# EAGLE design OSHW-RGB-Badge_v10 (EAGLE 6.6.0)
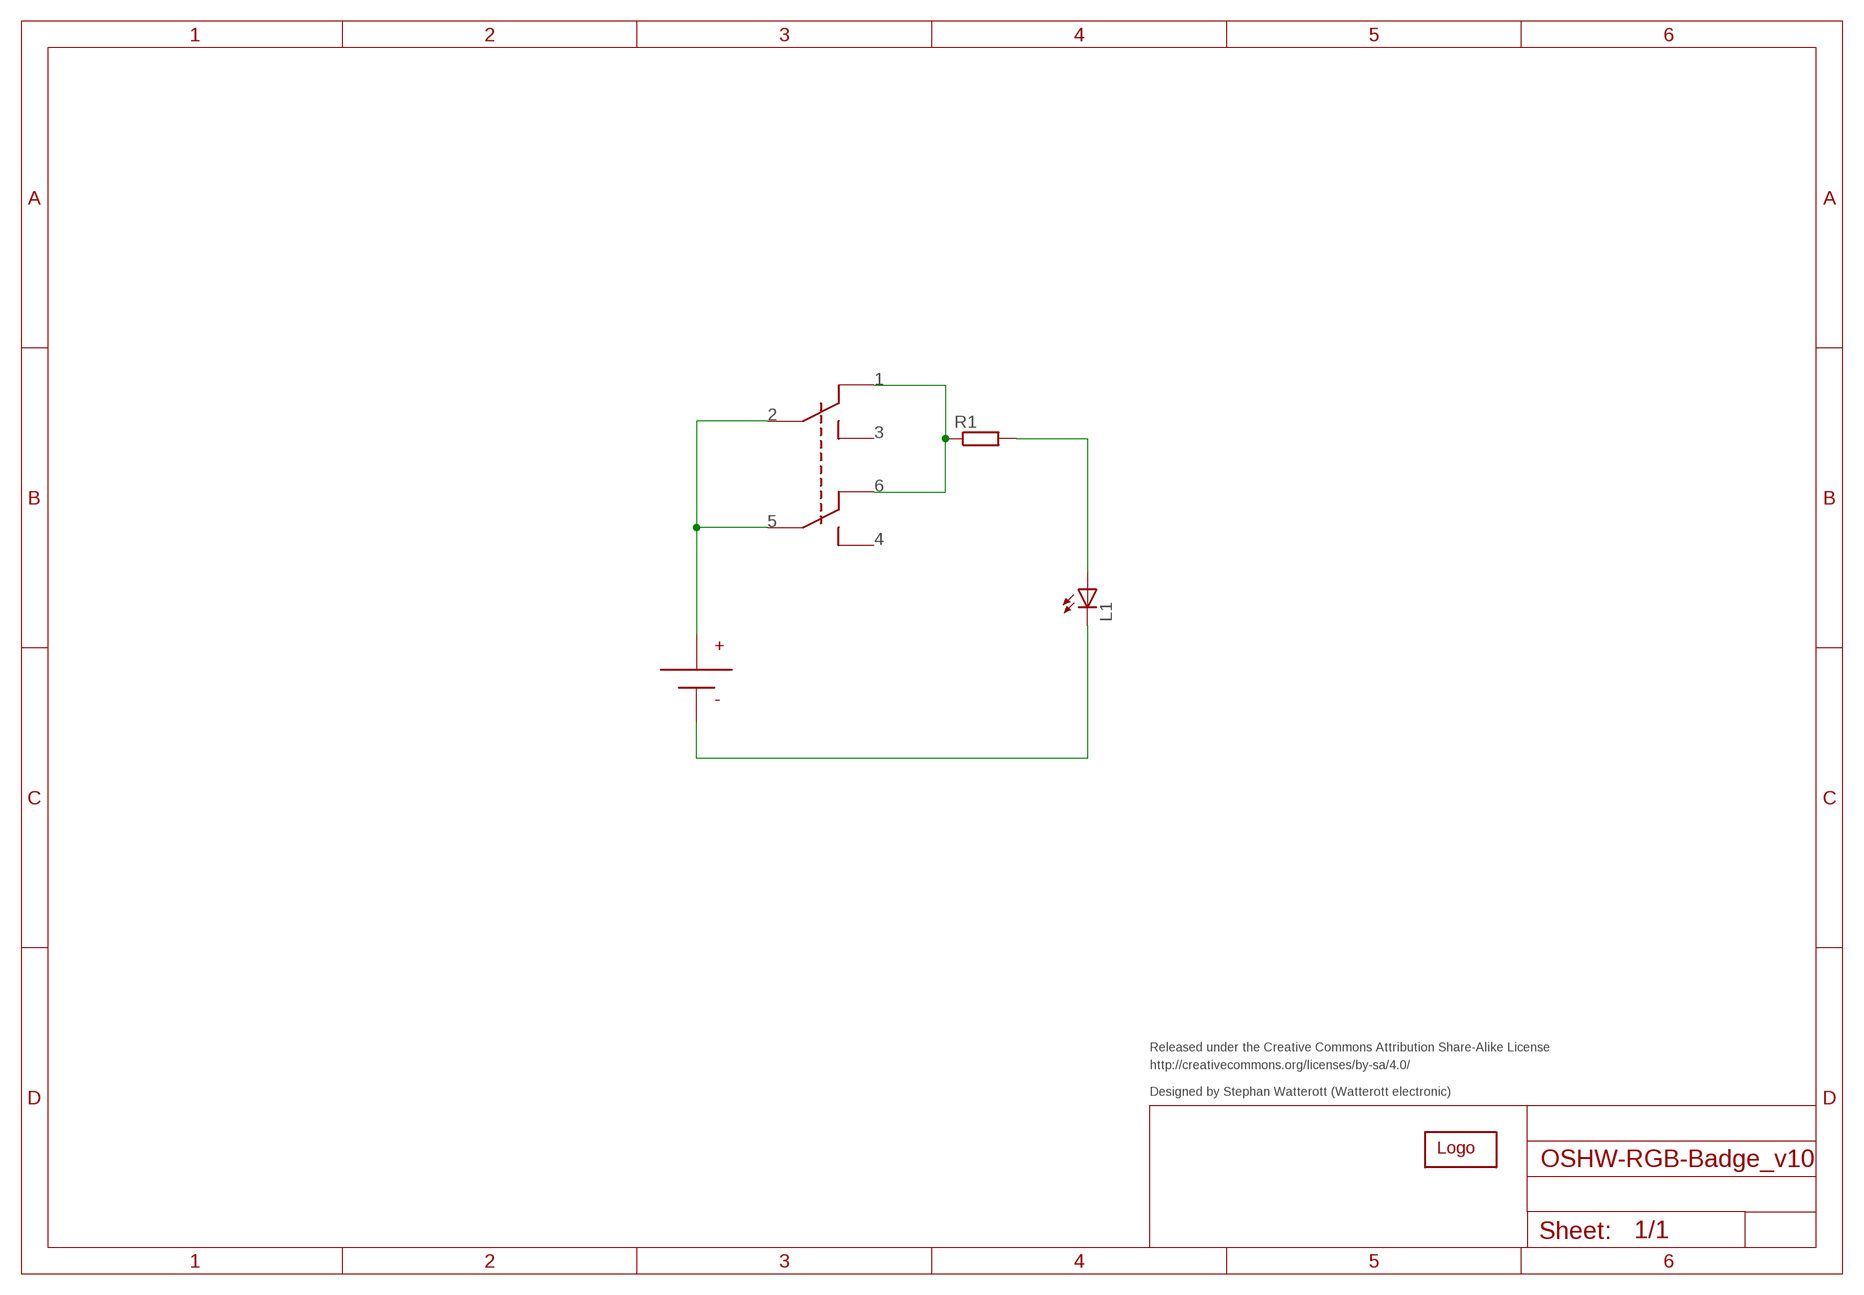
[diagram p0: schematic, sheet 1]

## Parts
L1  LED10MM  [LED10MM]
LOGO1  LOGOPLACE  [LOGO_TPLACE]
R1  R-EU_0207/7  [0207/7]
SW  SWITCH_6-POL_RM2.54  [SWITCH_6POL_RM2.54]
U$1  CN2032_BATTERY_HOLDER  [CN2032_BATTERY_HOLDER]

## Nets
N$1: R1.1 SW.P$1 SW.P$6
N$2: SW.P$2 SW.P$5 U$1.P$1(+)
N$3: L1.A R1.2
N$4: L1.K(C) U$1.P$2(-)
Unconnected: SW.P$3 SW.P$4

## Notes on the sheet
- Released under the Creative Commons Attribution Share-Alike License
- http://creativecommons.org/licenses/by-sa/4.0/
- Designed by Stephan Watterott (Watterott electronic)

## Library data of the parts
L1 = led:LED: LED OSRAM: - CHIPLED LG R971, LG N971, LY N971, LG Q971, LY Q971, LO R971, LY R971 LH N974, LH R974 LS Q976, LO Q976, LY Q976 LO Q996 - Hyper CHIPLED LW Q18S LB Q993, LB Q99A, LB R99A - SideLED LS A670, LO A670, LY A670, LG A670, LP A670 LB A673, LV A673, LT A673, LW A673 LH A674 LY A675 LS A676, LA A676, LO A676, LY A676, LW A676 LS A679, LY A679, LG A679 - Hyper Micro SIDELED® LS Y876, LA Y876, LO Y876, LY Y876 LT Y87S - SmartLED LW L88C, LW L88S LB L89C, LB L89S, LG L890 LS L89K, LO L89K, LY L89K LS L896, LA L896, LO L896, LY L896 - TOPLED LS T670, LO T670, LY T670, LG T670, LP T670 LSG T670, LSP T670, LSY T670, LOP T670, LYG T670 LG T671, LOG T671, LSG T671 LB T673, LV T673, LT T673, LW T673 LH T674 LS T676, LA T676, LO T676, LY T676, LB T676, LH T676, LSB T676, LW T676 LB T67C, LV T67C, LT T67C, LS T67K, LO T67K, LY T67K, LW E67C LS E67B, LA E67B, LO E67B, LY E67B, LB E67C, LV E67C, LT E67C LW T67C LS T679, LY T679, LG T679 LS T770, LO T770, LY T770, LG T770, LP T770 LB T773, LV T773, LT T773, LW T773 LH T774 LS E675, LA E675, LY E675, LS T675 LS T776, LA T776, LO T776, LY T776, LB T776 LHGB T686 LT T68C, LB T68C - Hyper Mini TOPLED® LB M676 - Mini TOPLED Santana® LG M470 LS M47K, LO M47K, LY M47K Source: http://www.osram.convergy.de LUXEON: - LUMILED® LXK2-PW12-R00, LXK2-PW12-S00, LXK2-PW14-U00, LXK2-PW14-V00 LXK2-PM12-R00, LXK2-PM12-S00, LXK2-PM14-U00 LXK2-PE12-Q00, LXK2-PE12-R00, LXK2-PE12-S00, LXK2-PE14-T00, LXK2-PE14-U00 LXK2-PB12-K00, LXK2-PB12-L00, LXK2-PB12-M00, LXK2-PB14-N00, LXK2-PB14-P00, LXK2-PB14-Q00 LXK2-PR12-L00, LXK2-PR12-M00, LXK2-PR14-Q00, LXK2-PR14-R00 LXK2-PD12-Q00, LXK2-PD12-R00, LXK2-PD12-S00 LXK2-PH12-R00, LXK2-PH12-S00 LXK2-PL12-P00, LXK2-PL12-Q00, LXK2-PL12-R00 Source: www.luxeon.com KINGBRIGHT: KA-3528ASYC Source: www.kingbright.com
LOGO1 = we-symbol:LOGO
R1 = resistor:R-EU_: RESISTOR, European symbol
SW = welectronic:SWITCH_6-POL_RM2.54
U$1 = CN2032:CN2032_BATTERY_HOLDER

## Board
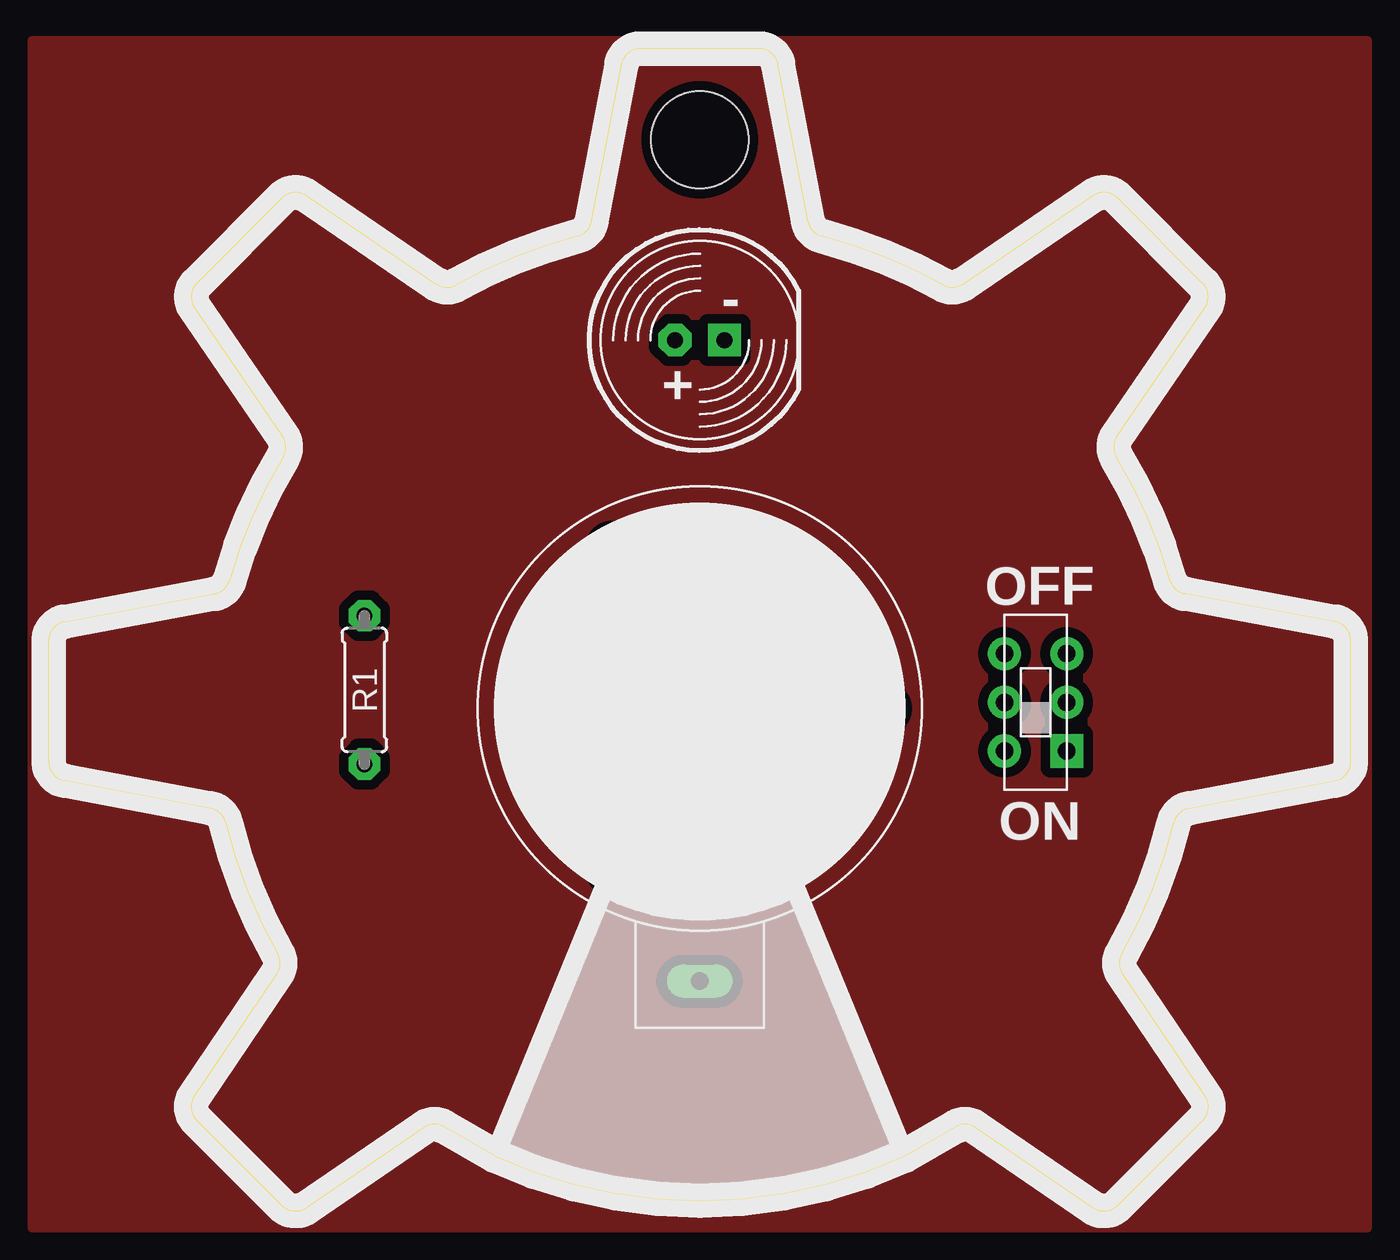
[diagram p1: board, top side]
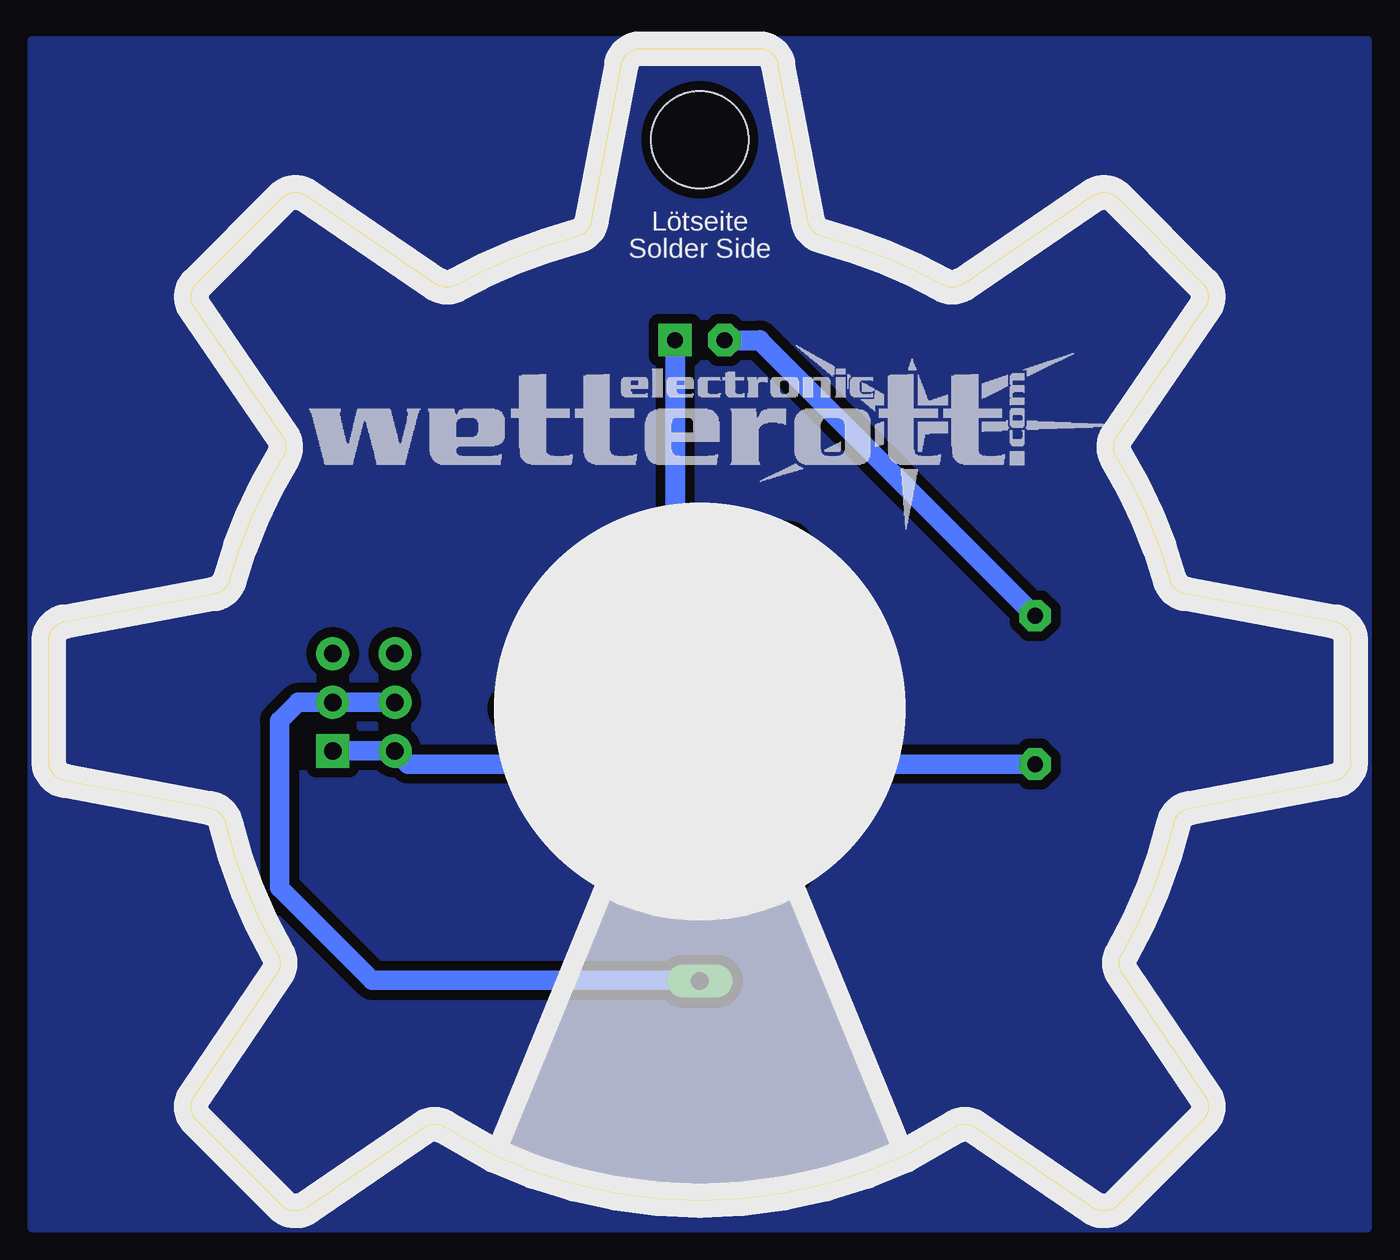
[diagram p2: board, bottom side, seen from below]

Size 66.91 x 59.71 mm. Coordinates in mm from the lower left corner, seen from the top.
Outline: 27.9,50.84 29.42,58.89 arc-79 30.41,59.71 36.51,59.71 arc-79 37.49,58.89 39.02,50.84 arc65 39.75,50.06 arc-15 45.94,47.57 arc64 46.99,47.61 53.66,52.15 arc-79 54.93,52.03 59.29,47.67 arc-79 59.41,46.4 54.9,39.81 arc66 54.87,38.72 arc-16 57.62,32.41 arc64 58.4,31.7 66.09,30.28 arc-80 66.91,29.29 66.91,23.08 arc-79 66.1,22.1 58.6,20.69 arc66 57.81,19.94 arc-17 55.15,13.23 arc64 55.18,12.17 59.42,5.92 arc-79 59.3,4.65 54.93,0.29 arc-79 53.66,0.17 47.65,4.28 arc64 46.59,4.32 44.01,2.83 arc-49 22.91,2.83 20.32,4.32 arc64 19.26,4.28 13.25,0.17 arc-79 11.98,0.29 7.62,4.65 arc-79 7.5,5.92 11.73,12.17 arc64 11.77,13.23 arc-17 9.1,19.94 arc66 8.31,20.69 0.81,22.1 arc-79 0,23.08 0,29.29 arc-80 0.82,30.28 8.51,31.7 arc64 9.3,32.41 arc-16 12.04,38.72 arc66 12.01,39.81 7.5,46.4 arc-79 7.62,47.67 11.98,52.03 arc-79 13.25,52.15 19.92,47.61 arc64 20.97,47.57 arc-15 27.16,50.06 arc65 27.9,50.84
Copper layers (1*16): Top 0.035mm / dielectric 1.5mm / Bottom 0.035mm
Design rules "watterott *": minimum track width 0.15mm, minimum drill 0.3mm, track to track 0.15mm, track to pad 0.15mm, pad to pad 0.15mm, via to via 0.15mm, smd to smd 0.1mm, copper to edge 0.15mm, drill to drill 0.15mm, minimum pad ring 0.4mm, minimum via ring 8mil, stop-mask expansion 4mil, vias tented up to drill 0.5mm, thermal gap 0.2mm
Holes 5 mm at 33.46,55.02

### Footprints (pad centres in the part's own frame; a part is rotated, then mirrored left to right if it is on the bottom)
LED10MM = drill 0.813 pad 1.676 octagon: A -1.27,0 | drill 0.813 pad 1.676 square: K 1.27,0
0207/7 = drill 0.813 octagon: 1 -3.81,0; 2 3.81,0
SWITCH_6POL_RM2.54 = drill 0.9 square: P$1 -1.6,2.5 | drill 0.9: P$2 -1.6,0; P$3 -1.6,-2.5; P$4 1.6,-2.5; P$5 1.6,0; P$6 1.6,2.5
CN2032_BATTERY_HOLDER = drill 0.9 long: P$1 0,-14; P$2 0,6 | hole 1.8: 9.5,0; -4.5,8.25; -4.5,-8.25

### Placement (x,y rotation side)
L1  33.46,44.74 0 top
LOGO1  53.78,34.7 0 bottom
R1  16.23,26.76 90 top
SW  50.72,26.13 180 top
U$1  33.45,25.81 0 top

### Tracks (layer width: path | path; a pad name or v marks a point on that pad's centre or on a via)
GND
  pour Bottom (isolate 0.5): -0.83,60.1 -0.83,-0.86 67.75,-0.86 67.75,60.1
  pour Top (isolate 0.5): -0.83,60.1 67.75,60.1 67.75,-0.86 -0.83,-0.86
N$1
  Bottom 1: R1.1 48.44,22.96 SW.P$6 SW.P$1
N$2
  Bottom 1: SW.P$2 SW.P$5 54.09,26.13 55.05,25.18 55.05,16.61 50.28,11.84 33.48,11.84 U$1.P$1
N$3
  Bottom 1.016: L1.A 30.39,44.74 R1.2
N$4
  Bottom 1: 34.76,35.05 34.34,34.63 33.46,33.75 U$1.P$2
  Bottom 1.016: L1.K 34.73,35.08 34.76,35.05

### Text on the board
tPlace: - | + | OFF | ON
bPlace: Lötseite | Solder Side
Reference: Silkscreen: 21 tPlace + 22 bPlace